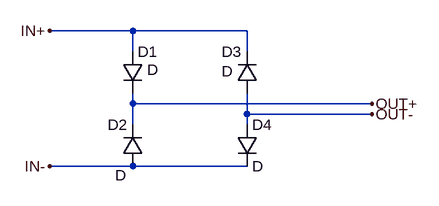
[diagram p0: schematic puentedediodos.asc]
puentedediodos.asc, the LTspice schematic file:
Version 4
SHEET 1 880 680
WIRE 112 32 -16 32
WIRE 288 32 112 32
WIRE 112 64 112 32
WIRE 288 64 288 32
WIRE 112 144 112 128
WIRE 480 144 112 144
WIRE 288 160 288 128
WIRE 480 160 288 160
WIRE 112 176 112 144
WIRE 288 176 288 160
WIRE 112 240 -16 240
WIRE 288 240 112 240
FLAG -16 32 IN+
FLAG -16 240 IN-
FLAG 480 144 OUT+
FLAG 480 160 OUT-
SYMBOL diode 96 64 R0
WINDOW 3 38 28 Left 2
SYMATTR InstName D1
SYMBOL diode 128 240 R180
WINDOW 0 24 64 Left 2
WINDOW 3 26 -14 Left 2
SYMATTR InstName D2
SYMBOL diode 304 128 R180
WINDOW 0 24 64 Left 2
WINDOW 3 38 34 Left 2
SYMATTR InstName D3
SYMBOL diode 272 176 R0
SYMATTR InstName D4

The netlist it stands for:
* puentedediodos.asc
D1 IN+ OUT+ D
D2 IN- OUT+ D
D3 OUT- IN+ D
D4 OUT- IN- D
.model D D
.lib standard.dio
.backanno
.end